# Altium project F405 Dev Board.PrjPcb
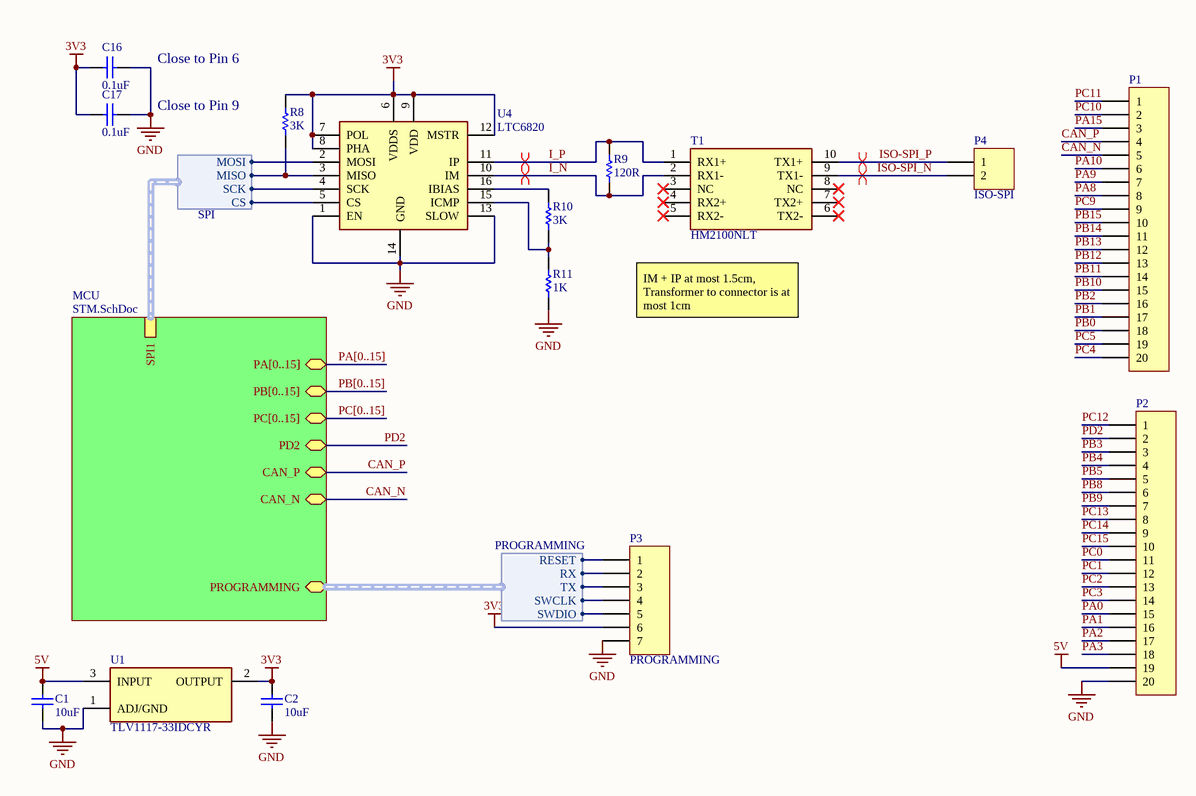
[diagram p0: Master.SchDoc]
2 sheets, 46 parts. Net scope: hierarchical (ports join the sheet entries above them; power ports are global).
Board file: Dev Board.PcbDoc
Sheets:
  Master.SchDoc
    MCU = STM.SchDoc

## Sheet Master.SchDoc: F405 Dev Board
size A4; Author: Alfonso Faria Espinoza; Organization: Waterloop; Address1: 200 University Ave W; Address2: Engineering 5, 1104; Address3: Waterloo, ON; Address4: N2L 3G1; Revision: 1.0; SheetNumber: 1; SheetTotal: 2

### Parts
C1  value 10uF  [0805 - Capacitor]  (hidden comment: Capacitor - Nonpolarized)
C2  value 10uF  [0805 - Capacitor]  (hidden comment: Capacitor - Nonpolarized)
C16  value 0.1uF  [0805 - Capacitor]  (hidden comment: Capacitor - Nonpolarized)
C17  value 0.1uF  [0805 - Capacitor]  (hidden comment: Capacitor - Nonpolarized)
P1  1x20 Header  [HDR1X20]  (value not drawn)
P2  1x20 Header  [HDR1X20]  (value not drawn)
P3  PROGRAMMING  [HDR1X7]
P4  ISO-SPI  [HDR1X2]
R8  value 3K  [0603 - Resistor]  (hidden comment: Resistor)
R9  value 120R  [0603 - Resistor]  (hidden comment: Resistor)
R10  value 3K  [0603 - Resistor]  (hidden comment: Resistor)
R11  value 1K  [0603 - Resistor]  (hidden comment: Resistor)
T1  HM2100NLT  [HM2100NLT]
U1  TLV1117-33IDCYR  [TLV1117]
U4  LTC6820  [LTC6820]

### Sub-sheets
MCU = STM.SchDoc: PA[0..15] (bidir), PB[0..15] (bidir), PC[0..15] (bidir), PD2 (bidir), CAN_P (bidir), CAN_N (bidir), SPI1 (harness SPI), PROGRAMMING (bidir, harness PROGRAMMING)

### Harnesses
SPI: CS, MISO, MOSI, SCK
PROGRAMMING: RESET, RX, SWCLK, SWDIO, TX

### Nets
3V3: C2.2 C16.2 C17.2 P3.6 R8.2 U1.2(OUTPUT) U4.6(VDDS) U4.7(POL) U4.8(PHA) U4.9(VDD) U4.12(MSTR)
5V: C1.2 P2.19 U1.3(INPUT)
GND: C1.1 C2.1 C16.1 C17.1 P2.20 P3.7 R11.1 U1.1(ADJ/GND) U4.1(EN) U4.13(SLOW) U4.14(GND)
CAN_N: P1.5 ; sheet MCU/CAN_N
CAN_P: P1.4 ; sheet MCU/CAN_P
I_N: R9.1 T1.2(RX1-) U4.10(IM)
I_P: R9.2 T1.1(RX1+) U4.11(IP)
ISO-SPI_N: P4.2 T1.9(TX1-)
ISO-SPI_P: P4.1 T1.10(TX1+)
PA0: P2.15
PA1: P2.16
PA2: P2.17
PA3: P2.18
PA8: P1.8
PA9: P1.7
PA10: P1.6
PA15: P1.3
PB0: P1.18
PB1: P1.17
PB2: P1.16
PB3: P2.3
PB4: P2.4
PB5: P2.5
PB8: P2.6
PB9: P2.7
PB10: P1.15
PB11: P1.14
PB12: P1.13
PB13: P1.12
PB14: P1.11
PB15: P1.10
PC0: P2.11
PC1: P2.12
PC2: P2.13
PC3: P2.14
PC4: P1.20
PC5: P1.19
PC9: P1.9
PC10: P1.2
PC11: P1.1
PC12: P2.1
PC13: P2.8
PC14: P2.9
PC15: P2.10
PD2: P2.2 ; sheet MCU/PD2
RESET: P3.1 ; sheet MCU/PROGRAMMING.RESET
RX: P3.2 ; sheet MCU/PROGRAMMING.RX
SWCLK: P3.4 ; sheet MCU/PROGRAMMING.SWCLK
SWDIO: P3.5 ; sheet MCU/PROGRAMMING.SWDIO
TX: P3.3 ; sheet MCU/PROGRAMMING.TX
NetR8_1: R8.1 U4.3(MISO) ; sheet MCU/SPI1.MISO
NetR10_1: R10.1 R11.2 U4.15(ICMP)
NetR10_2: R10.2 U4.16(IBIAS)
NetTP1_0: U4.4(SCK) ; sheet MCU/SPI1.SCK
NetTP3_0: U4.2(MOSI) ; sheet MCU/SPI1.MOSI
NetU2_20: U4.5(CS) ; sheet MCU/SPI1.CS

Not connected (* = marked no-connect by the designer): T1 3(NC)* 4(RX2+)* 5(RX2-)* 6(TX2-)* 7(TX2+)* 8(NC)*

### Buses and harness runs
bus PA[0..15] = sheet MCU/PA[0..15]
bus PB[0..15] = sheet MCU/PB[0..15]
bus PC[0..15] = sheet MCU/PC[0..15]

### Layout directives
differential pair; differential pair class ISO: ISO-SPI_N, ISO-SPI_P
differential pair: I_N, I_P

### Notes on the sheet
- Close to Pin 6
- Close to Pin 9
- (near T1) IM + IP at most 1.5cm, Transformer to connector is at most 1cm
- Title:
- Size:
- Date:
- A4
- Author:
- Revision:
- Sheet
- of
- File:

### Library data of the parts
C1 C2 = Capacitor - Nonpolarized: Nonpolarized Capacitor; Manufacturer: Murata; Manufacturer Part Number: GRM21BR71A106KA73K; Rating: 10V; Supplier Part Number: 490-14381-1-ND; Supplier: Digikey
C16 C17 = Capacitor - Nonpolarized: Nonpolarized Capacitor; Manufacturer: Yageo; Manufacturer Part Number: CC0805KRX7R9BB104; Rating: 50V; Supplier Part Number: 311-1140-1-ND; Supplier: Digikey
P1 P2 = 1x20 Header: 1x20 Pin Header
P3 = 1x7 Header: 1x7 Pin Header
P4 = 1x2 Header: 1x2 Pin Header
R8 R10 = Resistor: Manufacturer Part Number: RC0603FR-073KL; Manufacturer: Yageo; Rating: 0.1W; Supplier Part Number: 311-3.00KHRCT-ND; Supplier: Digikey
R9 = Resistor: Manufacturer Part Number: RC0603FR-07120RL; Manufacturer: Yageo; Rating: 0.1W; Supplier Part Number: 311-120HRCT-ND; Supplier: Digikey
R11 = Resistor: Manufacturer Part Number: RC0603FR-071KL; Manufacturer: Yageo; Rating: 0.1W; Supplier Part Number: 311-1.00KHRCT-ND; Supplier: Digikey
T1 = HM2100NLT: Pulse Transformer 1:1 Surface Mount 150µH, 450µH; Manufacturer: Pulse Electronics; Datasheet: https://productfinder.pulseeng.com/doc_type/WEB301/doc_num/HM2100NL/doc_part/HM2100NL.pdf; Supplier Part Number: 1840-1032-1-ND; Supplier: Digikey; Manufacturer Part Number: HM2100NLT
U1 = TLV1117-33IDCYR: Linear Voltage Regulator IC 3.3V 800MA SOT223-4; Manufacturer: Texas Instruments; Datasheet: http://www.ti.com/lit/ds/symlink/tlv1117.pdf?HQS=TI-null-null-digikeymode-df-pf-null-wwe&ts=1590668900314; Manufacturer Part Number: TLV1117-33IDCYR; Supplier Part Number: 296-21112-1-ND; Supplier: Digikey
U4 = LTC6820: Manufacturer: Analog Devices; Manufacturer Part Number: LTC6820IMS#TRPBF; Supplier: Digikey; Supplier Part Number: LTC6820IMS#TRPBFCT-ND

## Sheet STM.SchDoc: MCU
size A4; Author: Alfonso Faria Espinoza; Organization: Waterloop; Address1: 200 University Ave W; Address2: Engineering 5, 1104; Address3: Waterloo, ON; Address4: N2L 3G1; Revision: 1.0; SheetNumber: 2; SheetTotal: 2
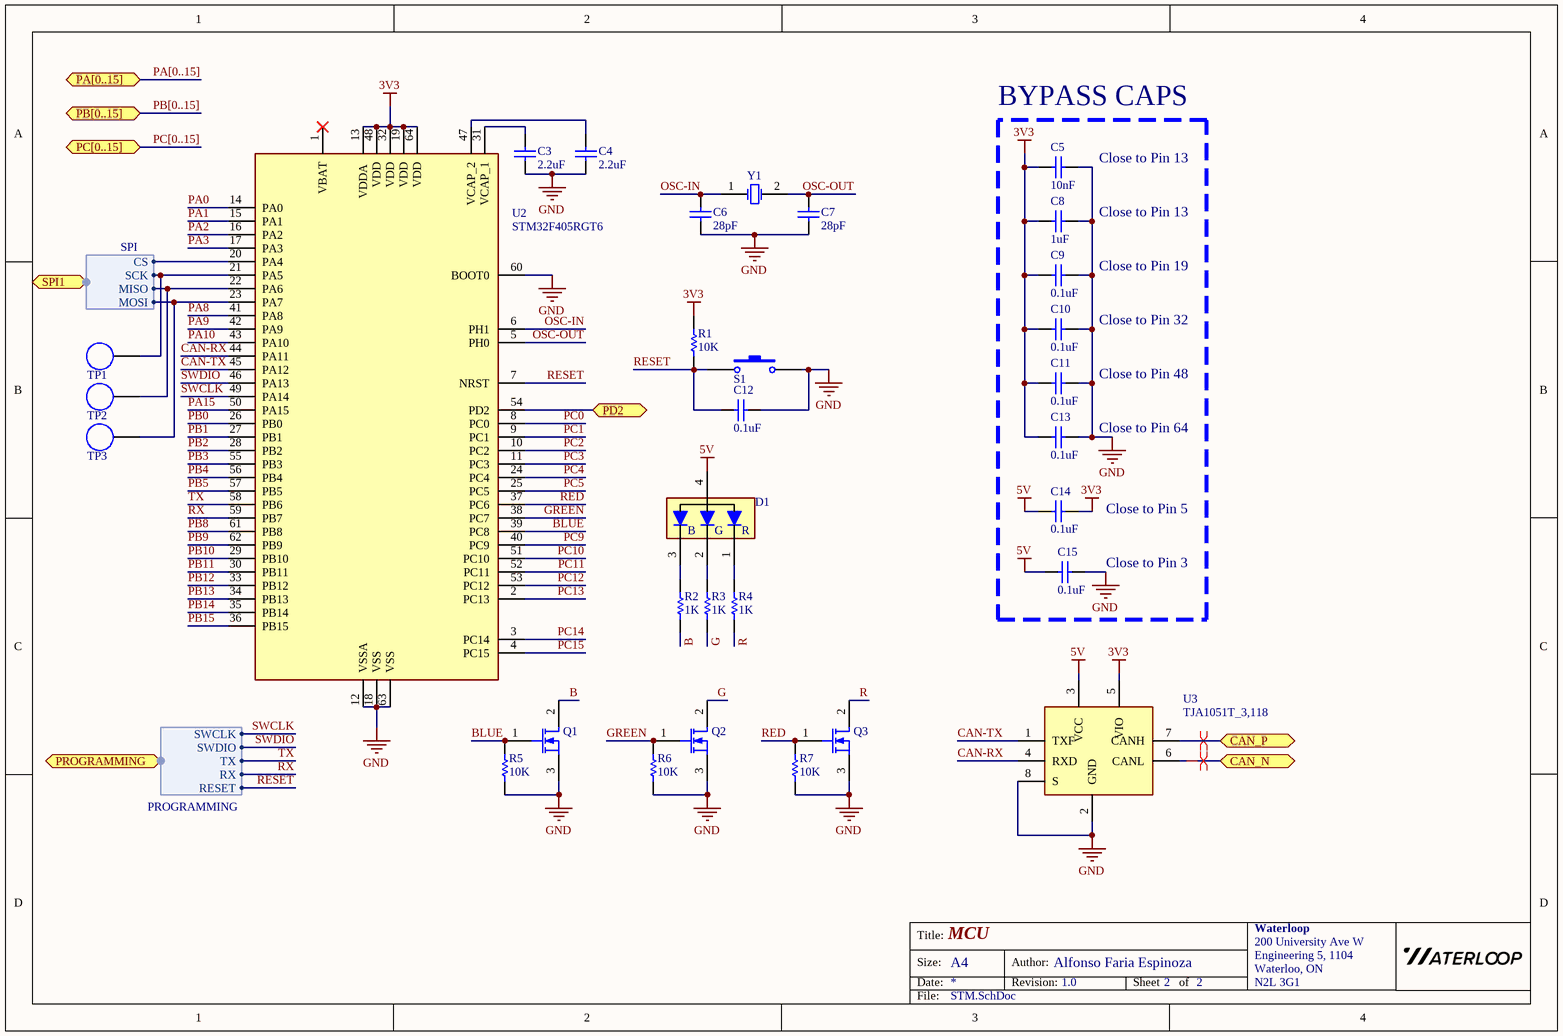
[diagram p1: STM.SchDoc]

### Parts
C3  value 2.2uF  [0805 - Capacitor]  (hidden comment: Capacitor - Nonpolarized)
C4  value 2.2uF  [0805 - Capacitor]  (hidden comment: Capacitor - Nonpolarized)
C5  value 10nF  [0805 - Capacitor]  (hidden comment: Capacitor - Nonpolarized)
C6  value 28pF  [0805 - Capacitor]  (hidden comment: Capacitor - Nonpolarized)
C7  value 28pF  [0805 - Capacitor]  (hidden comment: Capacitor - Nonpolarized)
C8  value 1uF  [0805 - Capacitor]  (hidden comment: Capacitor - Nonpolarized)
C9  value 0.1uF  [0805 - Capacitor]  (hidden comment: Capacitor - Nonpolarized)
C10  value 0.1uF  [0805 - Capacitor]  (hidden comment: Capacitor - Nonpolarized)
C11  value 0.1uF  [0805 - Capacitor]  (hidden comment: Capacitor - Nonpolarized)
C12  value 0.1uF  [0805 - Capacitor]  (hidden comment: Capacitor - Nonpolarized)
C13  value 0.1uF  [0805 - Capacitor]  (hidden comment: Capacitor - Nonpolarized)
C14  value 0.1uF  [0805 - Capacitor]  (hidden comment: Capacitor - Nonpolarized)
C15  value 0.1uF  [0805 - Capacitor]  (hidden comment: Capacitor - Nonpolarized)
D1  RGB LED- Common Anode  [4-PLCC RGB LED]  (value not drawn)
Q1  MOSFET-N  [SC70/SOT323]  (value not drawn)
Q2  MOSFET-N  [SC70/SOT323]  (value not drawn)
Q3  MOSFET-N  [SC70/SOT323]  (value not drawn)
R1  value 10K  [0603 - Resistor]  (hidden comment: Resistor)
R2  value 1K  [0603 - Resistor]  (hidden comment: Resistor)
R3  value 1K  [0603 - Resistor]  (hidden comment: Resistor)
R4  value 1K  [0603 - Resistor]  (hidden comment: Resistor)
R5  value 10K  [0603 - Resistor]  (hidden comment: Resistor)
R6  value 10K  [0603 - Resistor]  (hidden comment: Resistor)
R7  value 10K  [0603 - Resistor]  (hidden comment: Resistor)
S1  Switch - Push Button  [6x6mm Switch]  (value not drawn)
TP1  CLOCK  [Test Point]  (value not drawn)  (no BOM)
TP2  MISO  [Test Point]  (value not drawn)  (no BOM)
TP3  MOSI  [Test Point]  (value not drawn)  (no BOM)
U2  STM32F405RGT6  [STM32F405RG]
U3  TJA1051T_3,118  [TJA1051T/3,118]
Y1  Oscillator  [2-SMD NO LEAD CRSYSTAL]  (value not drawn)

### Blocks framed on the sheet
BYPASS CAPS: C5 C8-C11 C13-C15

### Ports
CAN_N (bidir), CAN_P (bidir), PA[0..15] (bidir), PB[0..15] (bidir), PC[0..15] (bidir), PD2 (bidir), PROGRAMMING (bidir, harness PROGRAMMING), SPI1 (bidir, harness SPI)

### Harnesses
SPI: CS, SCK, MISO, MOSI
PROGRAMMING: SWCLK, SWDIO, TX, RX, RESET

### Nets
3V3: C5.1 C8.1 C9.1 C10.1 C11.1 C13.1 C14.1 R1.2 U2.13(VDDA) U2.19(VDD) U2.32(VDD) U2.48(VDD) U2.64(VDD) U3.5(VIO)
5V: C14.2 C15.2 D1.4 U3.3(VCC)
GND: C3.1 C4.1 C5.2 C6.1 C7.1 C8.2 C9.2 C10.2 C11.2 C12.2 C13.2 C15.1 Q1.3(S) Q2.3(S) Q3.3(S) R5.1 R6.1 R7.1 S1.2 U2.12(VSSA) U2.18(VSS) U2.60(BOOT0) U2.63(VSS) U3.2(GND) U3.8(S)
B: Q1.2(D) R2.1
BLUE: Q1.1(G) R5.2 U2.39(PC8)
CAN-RX: U2.44(PA11) U3.4(RXD)
CAN-TX: U2.45(PA12) U3.1(TXF)
CAN_N: U3.6(CANL) ; port CAN_N
CAN_P: U3.7(CANH) ; port CAN_P
G: Q2.2(D) R3.1
GREEN: Q2.1(G) R6.2 U2.38(PC7)
OSC-IN: C6.2 U2.6(PH1) Y1.1(OSC1)
OSC-OUT: C7.2 U2.5(PH0) Y1.2(OSC2)
PA0: U2.14(PA0)
PA1: U2.15(PA1)
PA2: U2.16(PA2)
PA3: U2.17(PA3)
PA8: U2.41(PA8)
PA9: U2.42(PA9)
PA10: U2.43(PA10)
PA15: U2.50(PA15)
PB0: U2.26(PB0)
PB1: U2.27(PB1)
PB2: U2.28(PB2)
PB3: U2.55(PB3)
PB4: U2.56(PB4)
PB5: U2.57(PB5)
PB8: U2.61(PB8)
PB9: U2.62(PB9)
PB10: U2.29(PB10)
PB11: U2.30(PB11)
PB12: U2.33(PB12)
PB13: U2.34(PB13)
PB14: U2.35(PB14)
PB15: U2.36(PB15)
PC0: U2.8(PC0)
PC1: U2.9(PC1)
PC2: U2.10(PC2)
PC3: U2.11(PC3)
PC4: U2.24(PC4)
PC5: U2.25(PC5)
PC9: U2.40(PC9)
PC10: U2.51(PC10)
PC11: U2.52(PC11)
PC12: U2.53(PC12)
PC13: U2.2(PC13)
PC14: U2.3(PC14)
PC15: U2.4(PC15)
PD2: U2.54(PD2) ; port PD2
R: Q3.2(D) R4.1
RED: Q3.1(G) R7.2 U2.37(PC6)
RESET: C12.1 R1.1 S1.1 U2.7(NRST) ; port PROGRAMMING.RESET
RX: U2.59(PB7) ; port PROGRAMMING.RX
SWCLK: U2.49(PA14) ; port PROGRAMMING.SWCLK
SWDIO: U2.46(PA13) ; port PROGRAMMING.SWDIO
TX: U2.58(PB6) ; port PROGRAMMING.TX
NetC3_2: C3.2 U2.31(VCAP_1)
NetC4_2: C4.2 U2.47(VCAP_2)
NetD1_1: D1.1 R4.2
NetD1_2: D1.2 R3.2
NetD1_3: D1.3 R2.2
NetR8_1: TP2.0 U2.22(PA6) ; port SPI1.MISO
NetTP1_0: TP1.0 U2.21(PA5) ; port SPI1.SCK
NetTP3_0: TP3.0 U2.23(PA7) ; port SPI1.MOSI
NetU2_20: U2.20(PA4) ; port SPI1.CS

Not connected (* = marked no-connect by the designer): U2 1(VBAT)*

### Buses and harness runs
bus PA[0..15] = port PA[0..15]
bus PB[0..15] = port PB[0..15]
bus PC[0..15] = port PC[0..15]

### Layout directives
differential pair; differential pair class CAN: CAN_N, CAN_P

### Notes on the sheet
- (near C5) Close to Pin 13
- Close to Pin 13
- Close to Pin 19
- Close to Pin 32
- Close to Pin 48
- Close to Pin 64
- Close to Pin 5
- (near C15) Close to Pin 3
- Title:
- Size:
- Date:
- A4
- Author:
- Revision:
- Sheet
- of
- File:
- (in symbol RGB LED- Common Anode) B; G; R

### Library data of the parts
C3 C4 = Capacitor - Nonpolarized: Nonpolarized Capacitor; Manufacturer: Samsung; Manufacturer Part Number: CL21B225KPFNNNE; Rating: 10V; Supplier Part Number: 1276-1188-1-ND; Supplier: Digikey
C5 = Capacitor - Nonpolarized: Nonpolarized Capacitor; Manufacturer: Yageo; Manufacturer Part Number: CC0805KRX7R9BB103; Rating: 50V; Supplier Part Number: 311-1136-1-ND; Supplier: Digikey
C6 C7 = Capacitor - Nonpolarized: Nonpolarized Capacitor; Manufacturer: Samsung; Manufacturer Part Number: CL21C270JCANNNC; Rating: 100V; Supplier Part Number: 1276-2622-1-ND; Supplier: Digikey
C8 = Capacitor - Nonpolarized: Nonpolarized Capacitor; Manufacturer: Yageo; Manufacturer Part Number: CC0805KKX7R9BB105; Rating: 50V; Supplier Part Number: 311-1886-1-ND; Supplier: Digikey
C9-C15 = Capacitor - Nonpolarized: as C16 on sheet Master; Supplier Part Number: 311-1140-1-ND; Supplier: Digikey
D1 = RGB LED- Common Anode: Manufacturer Part Number: AAA3528LSEEZGKQBKS; Manufacturer: Kingbright; Supplier: Digikey; Supplier Part Number: 754-1967-1-ND
Q1-Q3 = MOSFET-N: N-Channel MOSFET; Manufacturer Part Number: NVS4409NT1G; Manufacturer: ON SEMI; Rating: 25V; Value: NVS4409NT1G; Supplier: Digikey; Supplier Part Number: NVS4409NT1GOSCT-ND
R1 R5-R7 = Resistor: Manufacturer Part Number: RC0603FR-0710KL; Manufacturer: Yageo; Rating: 0.1W; Supplier Part Number: 311-10.0KHRCT-ND; Supplier: Digikey
R2-R4 = Resistor: as R11 on sheet Master; Supplier Part Number: 311-1.00KHRCT-ND; Supplier: Digikey
S1 = Switch - Push Button: Push Button Switch; Manufacturer Part Number: 1301.9315; Manufacturer: Schurter; Supplier: Digikey; Supplier Part Number: 486-3466-ND; Rating: *; Value: *
TP1-TP3 = Test Point
U2 = STM32F405RGT6: ST 64-pin Micro; Manufacturer Part Number: STM32F405RGT7; Manufacturer: ST; Supplier: Digikey; Supplier Part Number: 497-17433-ND
U3 = TJA1051T_3,118: CAN Transceiver IC 4.5V-5.5V 250ns; Manufacturer: NXP; Datasheet: http://www.nxp.com/docs/en/data-sheet/TJA1051.pdf; Manufacturer Part Number: TJA1051T/3,118; Supplier Part Number: 568-8684-1-ND; Supplier: Digikey
Y1 = Oscillator: Crystal Oscillator; Manufacturer Part Number: ABM3-16.000MHZ-B2-T; Manufacturer: Abracon; Rating: 18pF; Value: 16MHz; Supplier Part Number: 535-9103-1-ND; Supplier: Digikey

## Nets that join several sheets
3V3: Master (11 pins), STM (14 pins)
5V: Master (C1.2 P2.19 U1.3), STM (C14.2 C15.2 D1.4 U3.3)
GND: Master (11 pins), STM (25 pins)
CAN_N: Master (P1.5), STM (U3.6)
CAN_P: Master (P1.4), STM (U3.7)
NetR8_1: Master (R8.1 U4.3), STM (TP2.0 U2.22)
NetTP1_0: Master (U4.4), STM (TP1.0 U2.21)
NetTP3_0: Master (U4.2), STM (TP3.0 U2.23)
NetU2_20: Master (U4.5), STM (U2.20)
PA0: Master (P2.15), STM (U2.14)
PA1: Master (P2.16), STM (U2.15)
PA2: Master (P2.17), STM (U2.16)
PA3: Master (P2.18), STM (U2.17)
PA8: Master (P1.8), STM (U2.41)
PA9: Master (P1.7), STM (U2.42)
PA10: Master (P1.6), STM (U2.43)
PA15: Master (P1.3), STM (U2.50)
PB0: Master (P1.18), STM (U2.26)
PB1: Master (P1.17), STM (U2.27)
PB2: Master (P1.16), STM (U2.28)
PB3: Master (P2.3), STM (U2.55)
PB4: Master (P2.4), STM (U2.56)
PB5: Master (P2.5), STM (U2.57)
PB8: Master (P2.6), STM (U2.61)
PB9: Master (P2.7), STM (U2.62)
PB10: Master (P1.15), STM (U2.29)
PB11: Master (P1.14), STM (U2.30)
PB12: Master (P1.13), STM (U2.33)
PB13: Master (P1.12), STM (U2.34)
PB14: Master (P1.11), STM (U2.35)
PB15: Master (P1.10), STM (U2.36)
PC0: Master (P2.11), STM (U2.8)
PC1: Master (P2.12), STM (U2.9)
PC2: Master (P2.13), STM (U2.10)
PC3: Master (P2.14), STM (U2.11)
PC4: Master (P1.20), STM (U2.24)
PC5: Master (P1.19), STM (U2.25)
PC9: Master (P1.9), STM (U2.40)
PC10: Master (P1.2), STM (U2.51)
PC11: Master (P1.1), STM (U2.52)
PC12: Master (P2.1), STM (U2.53)
PC13: Master (P2.8), STM (U2.2)
PC14: Master (P2.9), STM (U2.3)
PC15: Master (P2.10), STM (U2.4)
PD2: Master (P2.2), STM (U2.54)
RESET: Master (P3.1), STM (C12.1 R1.1 S1.1 U2.7)
RX: Master (P3.2), STM (U2.59)
SWCLK: Master (P3.4), STM (U2.49)
SWDIO: Master (P3.5), STM (U2.46)
TX: Master (P3.3), STM (U2.58)